# EAGLE schematic RHD2132_lvds_headstage_3_1 (EAGLE 6.3)
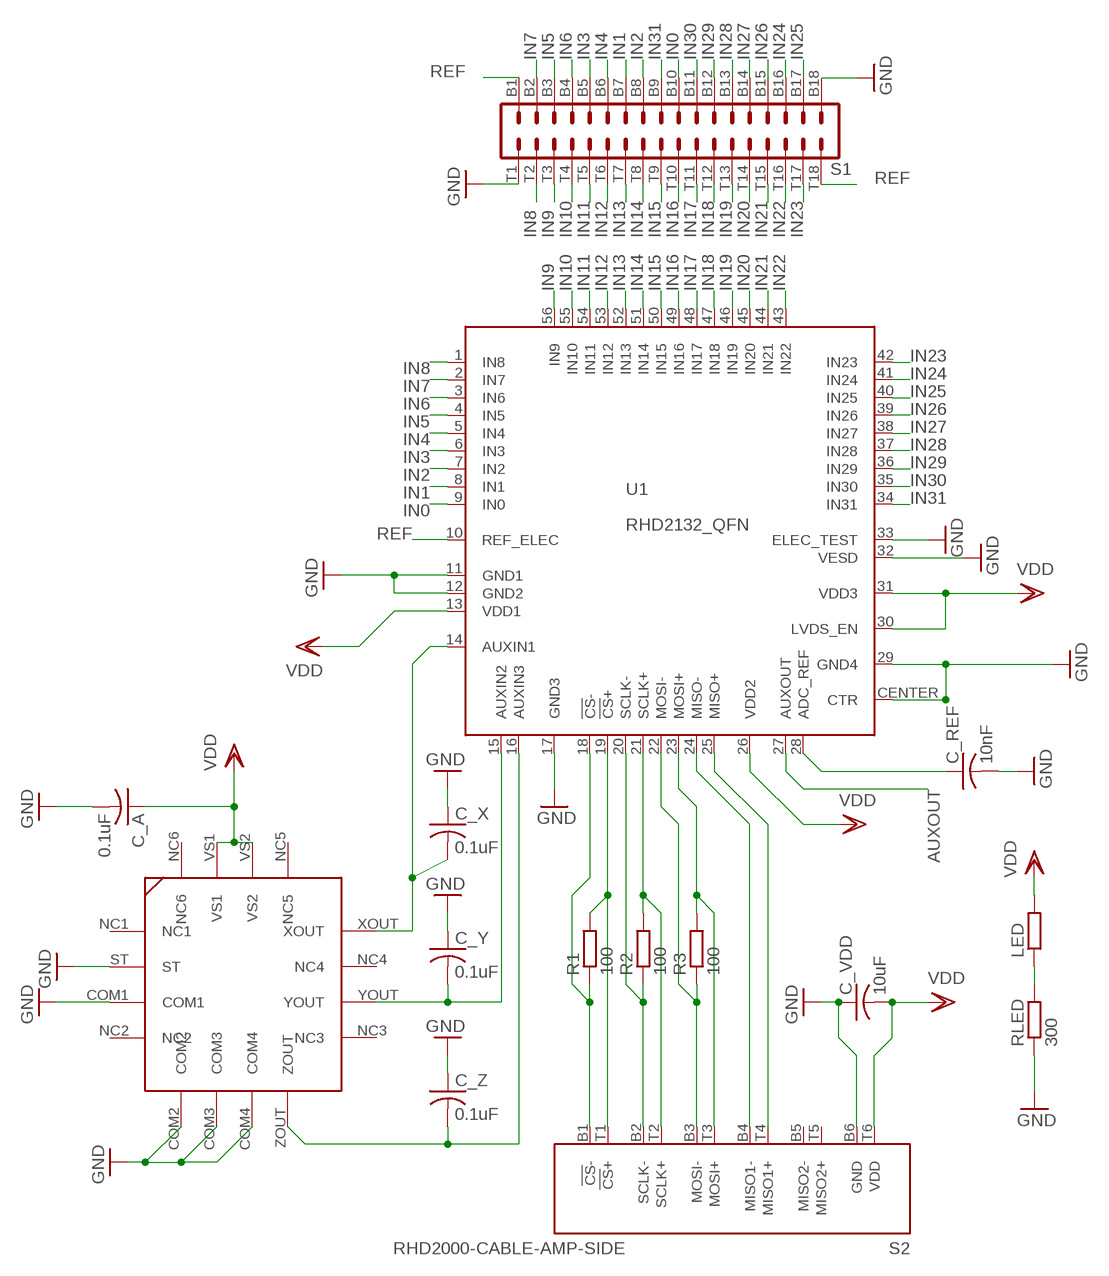
[diagram p0: schematic, sheet 1]

## Parts
C_A  0.1uF  C-USC0402K  [C0402K]
C_REF  10nF  C-USC0402K  [C0402K]
C_VDD  10uF  C-USC0402K  [C0402K]
C_X  0.1uF  C-USC0402K  [C0402K]
C_Y  0.1uF  C-USC0402K  [C0402K]
C_Z  0.1uF  C-USC0402K  [C0402K]
LED  R-EU_R0402  [R0402]
R1  100  R-EU_R0402  [R0402]
R2  100  R-EU_R0402  [R0402]
R3  100  R-EU_R0402  [R0402]
RLED  300  R-EU_R0402  [R0402]
S1  OMNETICS_A79025  [OMNETICS_A79025]
S2  RHD2000-CABLE-AMP-SIDE  [OMNETICS_PZN-12-AA]
U1  RHD2132_QFN  [QFN56_8_X_8_LARGE]
U$1  ADXL335  [ADXL335]

## Nets
ADC_REF: C_REF.1 U1.28(ADC_REF)
AUXOUT: U1.27(AUXOUT)
CS+: R1.2 S2.T1(!CS!+) U1.19(!CS!+)
CS-: R1.1 S2.B1(!CS!-) U1.18(!CS!-)
GND: C_A.2 C_REF.2 C_VDD.1 C_X.1 C_Y.1 C_Z.1 RLED.1 S1.B18 S1.T1 S2.B6(GND) U1.11(GND1) U1.12(GND2) U1.17(GND3) U1.29(GND4) U1.32(VESD) U1.33(ELEC_TEST) U1.CENTER(CTR) U$1.COM1 U$1.COM2 U$1.COM3 U$1.COM4 U$1.ST
IN0: S1.B10 U1.9(IN0)
IN1: S1.B7 U1.8(IN1)
IN2: S1.B8 U1.7(IN2)
IN3: S1.B5 U1.6(IN3)
IN4: S1.B6 U1.5(IN4)
IN5: S1.B3 U1.4(IN5)
IN6: S1.B4 U1.3(IN6)
IN7: S1.B2 U1.2(IN7)
IN8: S1.T2 U1.1(IN8)
IN9: S1.T3 U1.56(IN9)
IN10: S1.T4 U1.55(IN10)
IN11: S1.T5 U1.54(IN11)
IN12: S1.T6 U1.53(IN12)
IN13: S1.T7 U1.52(IN13)
IN14: S1.T8 U1.51(IN14)
IN15: S1.T9 U1.50(IN15)
IN16: S1.T10 U1.49(IN16)
IN17: S1.T11 U1.48(IN17)
IN18: S1.T12 U1.47(IN18)
IN19: S1.T13 U1.46(IN19)
IN20: S1.T14 U1.45(IN20)
IN21: S1.T15 U1.44(IN21)
IN22: S1.T16 U1.43(IN22)
IN23: S1.T17 U1.42(IN23)
IN24: S1.B16 U1.41(IN24)
IN25: S1.B17 U1.40(IN25)
IN26: S1.B15 U1.39(IN26)
IN27: S1.B14 U1.38(IN27)
IN28: S1.B13 U1.37(IN28)
IN29: S1.B12 U1.36(IN29)
IN30: S1.B11 U1.35(IN30)
IN31: S1.B9 U1.34(IN31)
LEDOUT: LED.1 RLED.2
MISO1+: S2.T4(MISO1+) U1.25(MISO+)
MISO1-: S2.B4(MISO1-) U1.24(MISO-)
MOSI+: R3.2 S2.T3(MOSI+) U1.23(MOSI+)
MOSI-: R3.1 S2.B3(MOSI-) U1.22(MOSI-)
REF: S1.B1 S1.T18 U1.10(REF_ELEC)
SCLK+: R2.2 S2.T2(SCLK+) U1.21(SCLK+)
SCLK-: R2.1 S2.B2(SCLK-) U1.20(SCLK-)
VDD: C_A.1 C_VDD.2 LED.2 S2.T6(VDD) U1.13(VDD1) U1.26(VDD2) U1.30(LVDS_EN) U1.31(VDD3) U$1.VS1 U$1.VS2
XOUT: C_X.2 U1.14(AUXIN1) U$1.XOUT
YOUT: C_Y.2 U1.15(AUXIN2) U$1.YOUT
ZOUT: C_Z.2 U1.16(AUXIN3) U$1.ZOUT
Unconnected: S2.B5(MISO2-) S2.T5(MISO2+) U$1.NC1 U$1.NC2 U$1.NC3 U$1.NC4 U$1.NC5 U$1.NC6

## Library data of the parts
C_A C_REF C_VDD C_X C_Y C_Z = resistor:C-US: CAPACITOR, American symbol
LED R1-R3 RLED = resistor:R-EU_: RESISTOR, European symbol
S1 = RHD2000:OMNETICS_A79025
S2 = RHD2000:RHD2000-CABLE-AMP-SIDE
U1 = RHD2000:RHD2132
U$1 = voigts:ADXL335: The ADXL335 is a small, thin, low power, complete 3-axis accelerometer with signal conditioned voltage outputs. The product measures acceleration with a minimum full-scale range of ±3 g. It can measure the static acceleration of gravity in tilt-sensing applications, as well as dynamic acceleration resulting from motion, shock, or vibration. The user selects the bandwidth of the accelerometer using the CX, CY, and CZ capacitors at the XOUT, YOUT, and ZOUT pins. Bandwidths can be selected to suit the application, with a range of 0.5 Hz to 1600 Hz for the X and Y axes, and a range of 0.5 Hz to 550 Hz for the Z axi